# EAGLE design Pi3B+_Adapter (EAGLE 9.4.2)
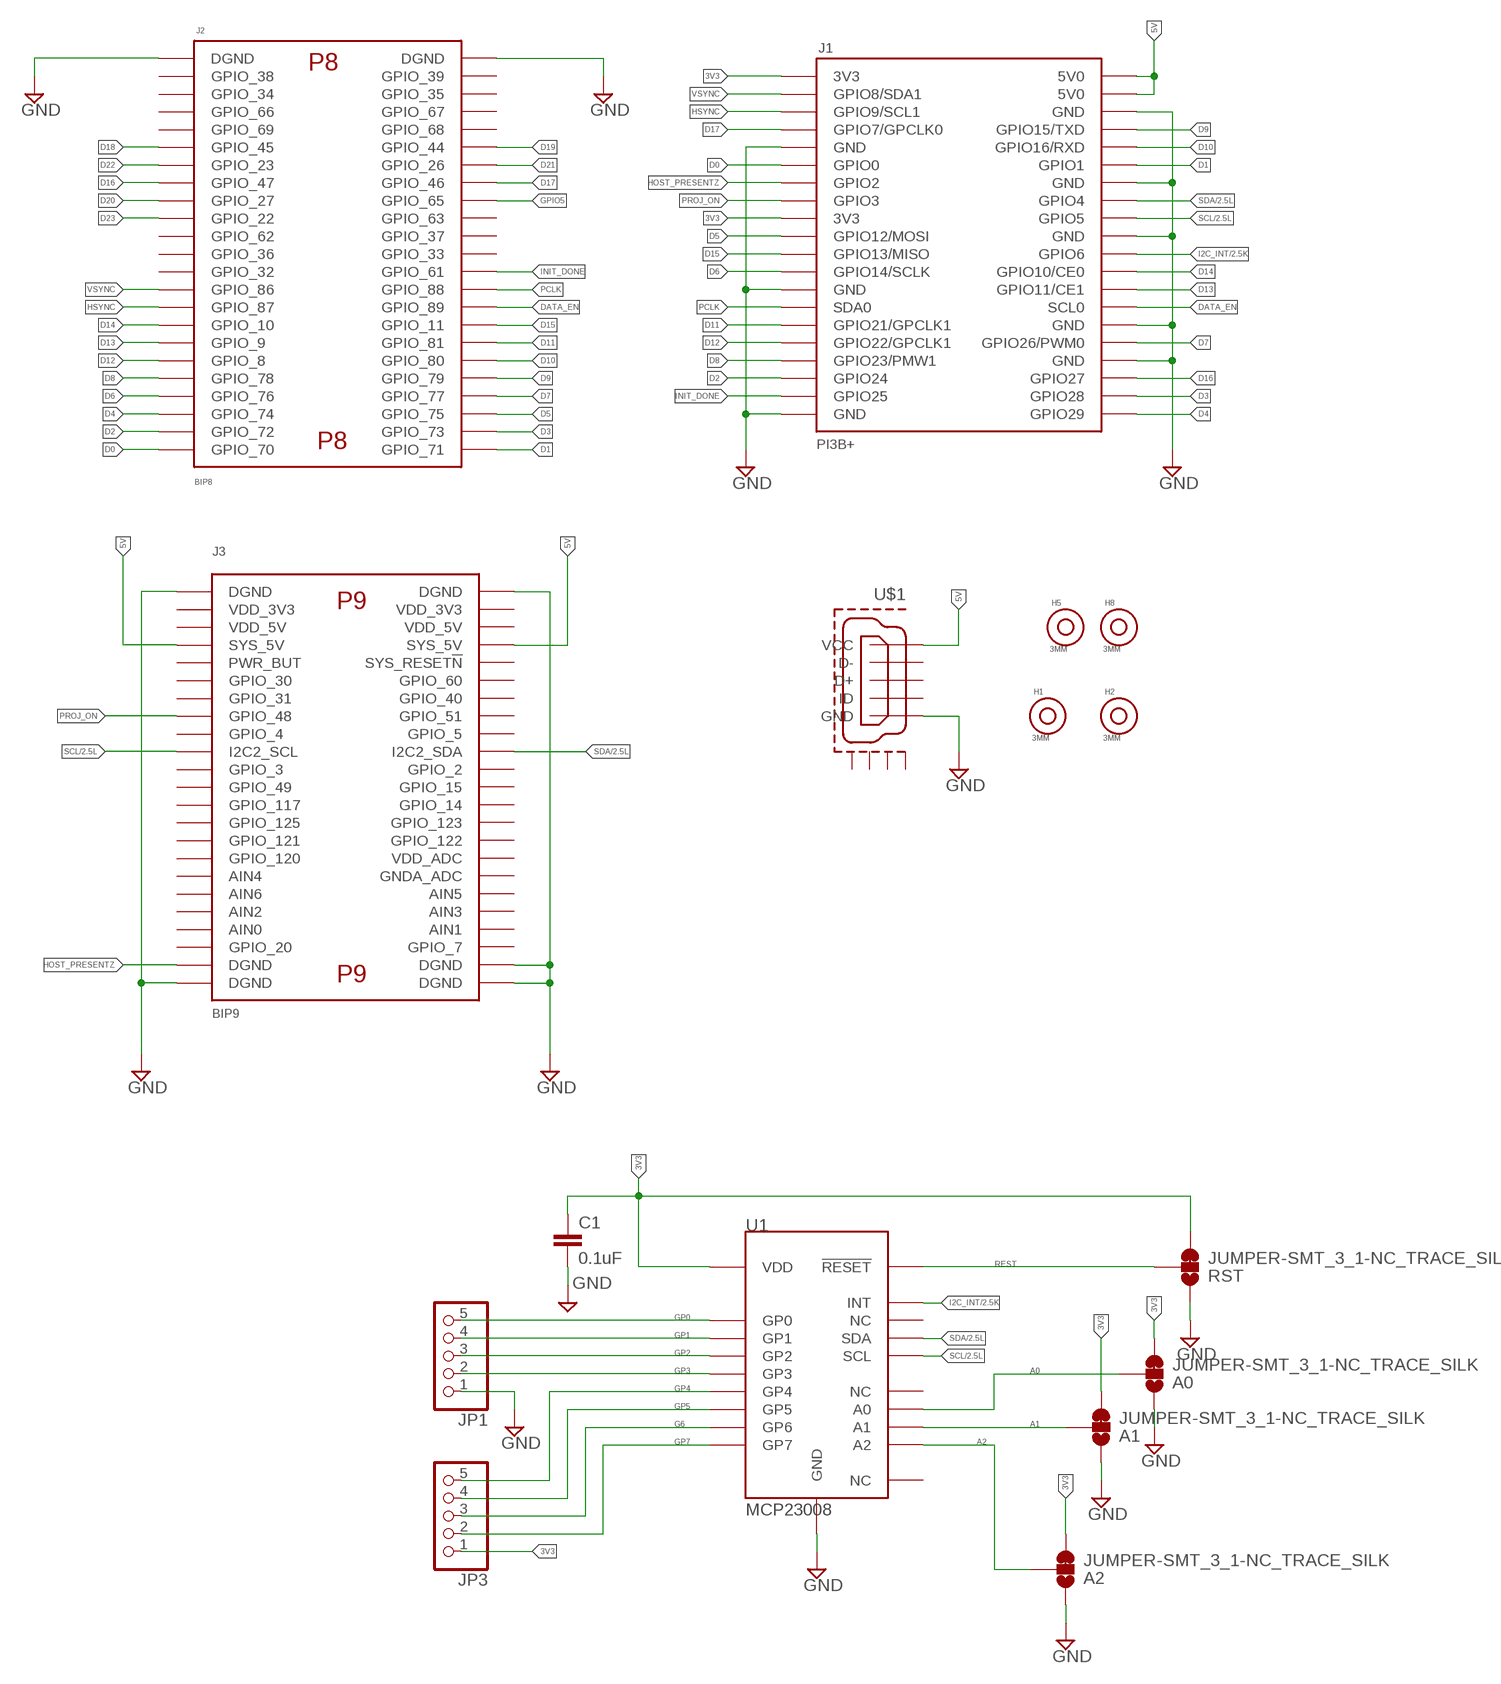
[diagram p0: schematic, sheet 1]

## Parts
A0  JUMPER-SMT_3_1-NC_TRACE_SILK  [SMT-JUMPER_3_1-NC_TRACE_SILK]
A1  JUMPER-SMT_3_1-NC_TRACE_SILK  [SMT-JUMPER_3_1-NC_TRACE_SILK]
A2  JUMPER-SMT_3_1-NC_TRACE_SILK  [SMT-JUMPER_3_1-NC_TRACE_SILK]
C1  0.1uF  0.1UF-0402-16V-10%  [0402]
H1  3MM  [3MM]
H2  3MM  [3MM]
H5  3MM  [3MM]
H8  3MM  [3MM]
J1  PI3B+  [PI3B+]
J2  BIP8  [BIP8]
J3  BIP9  [BIP9]
JP1  PINHD-1X55X2MM  [1_05X2MM]
JP3  PINHD-1X55X2MM  [1_05X2MM]
RST  JUMPER-SMT_3_1-NC_TRACE_SILK  [SMT-JUMPER_3_1-NC_TRACE_SILK]
U1  MCP23008  [MCP23008SS]
U$1  MICRO-USB-RECEPTACLE47589-0001  [47589-0001]

## Nets
3V3: A0.3 A1.3 A2.3 C1.1 J1.3V3 J1.3V3@1(3V3) JP3.1 RST.3 U1.VDD
5V: J1.5V0 J1.5V0@1(5V0) J3.SYS_5V J3.SYS_5V@1(SYS_5V) U$1.V-BUS(VCC)
A0: A0.2 U1.A0
A1: A1.2 U1.A1
A2: A2.2 U1.A2
D0: J1.GPIO0 J2.GPIO_70
D1: J1.GPIO1 J2.GPIO_71
D2: J1.GPIO24 J2.GPIO_72
D3: J1.GPIO28 J2.GPIO_73
D4: J1.GPIO29 J2.GPIO_74
D5: J1.GPIO12/MOSI J2.GPIO_75
D6: J1.GPIO14/SCLK J2.GPIO_76
D7: J1.GPIO26/PMW0(GPIO26/PWM0) J2.GPIO_77
D8: J1.GPIO23/PWM1(GPIO23/PMW1) J2.GPIO_78
D9: J1.GPIO15/TXD J2.GPIO_79
D10: J1.GPIO16/RXD J2.GPIO_80
D11: J1.GPIO21/GPCLK1 J2.GPIO_81
D12: J1.GPIO22/GPCLK2(GPIO22/GPCLK1) J2.GPIO_8
D13: J1.GPIO11/CE1 J2.GPIO_9
D14: J1.GPIO10/CE0 J2.GPIO_10
D15: J1.GPIO13/MISO J2.GPIO_11
D16: J1.GPIO27 J2.GPIO_47
D17: J1.GPIO7/GPCLK0 J2.GPIO_46
D18: J2.GPIO_45
D19: J2.GPIO_44
D20: J2.GPIO_27
D21: J2.GPIO_26
D22: J2.GPIO_23
D23: J2.GPIO_22
DATA_EN: J1.SCL0 J2.GPIO_89
G6: JP3.3 U1.GP6
GND: A0.1 A1.1 A2.1 C1.2 J1.GND J1.GND@1(GND) J1.GND@2(GND) J1.GND@3(GND) J1.GND@4(GND) J1.GND@5(GND) J1.GND@6(GND) J1.GND@7(GND) J2.DGND J2.DGND@1(DGND) J3.DGND J3.DGND@1(DGND) J3.DGND@4(DGND) J3.DGND@5(DGND) J3.DGND@6(DGND) JP1.1 RST.1 U1.GND U$1.GND
GP0: JP1.5 U1.GP0
GP1: JP1.4 U1.GP1
GP2: JP1.3 U1.GP2
GP3: JP1.2 U1.GP3
GP4: JP3.5 U1.GP4
GP5: JP3.4 U1.GP5
GP7: JP3.2 U1.GP7
GPIO5: J2.GPIO_65
HOST_PRESENTZ: J1.GPIO2 J3.DGND@3(DGND)
HSYNC: J1.GPIO9/SCL1 J2.GPIO_87
I2C_INT/2.5K: J1.GPIO6 U1.INT
INIT_DONE: J1.GPIO25 J2.GPIO_61
PCLK: J1.SDA0 J2.GPIO_88
PROJ_ON: J1.GPIO3 J3.GPIO_48
REST: RST.2 U1.!RESET
SCL/2.5L: J1.GPIO5 J3.I2C2_SCL U1.SCL
SDA/2.5L: J1.GPIO4 J3.I2C2_SDA U1.SDA
VSYNC: J1.GPIO8/SDA1 J2.GPIO_86
Unconnected: J2.GPIO_32 J2.GPIO_33 J2.GPIO_34 J2.GPIO_35 J2.GPIO_36 J2.GPIO_37 J2.GPIO_38 J2.GPIO_39 J2.GPIO_62 J2.GPIO_63 J2.GPIO_66 J2.GPIO_67 J2.GPIO_68 J2.GPIO_69 J3.AIN0 J3.AIN1 J3.AIN2 J3.AIN3 J3.AIN4 J3.AIN5 J3.AIN6 J3.GNDA_ADC J3.GPIO_2 J3.GPIO_3 J3.GPIO_4 J3.GPIO_5 J3.GPIO_7 J3.GPIO_14 J3.GPIO_15 J3.GPIO_20 J3.GPIO_30 J3.GPIO_31 J3.GPIO_40 J3.GPIO_49 J3.GPIO_51 J3.GPIO_60 J3.GPIO_117 J3.GPIO_120 J3.GPIO_121 J3.GPIO_122 J3.GPIO_123 J3.GPIO_125 J3.PWR_BUT J3.SYS_RESET!N J3.VDD_3V3 J3.VDD_3V3@1(VDD_3V3) J3.VDD_5V J3.VDD_5V@1(VDD_5V) J3.VDD_ADC U1.NC U1.NC@1(NC) U1.NC@2(NC) U$1.CASING1(GND1) U$1.CASING2(GND2) U$1.CASING3(GND3) U$1.CASING4(GND4) U$1.D+ U$1.D- U$1.ID

## Library data of the parts
A0 A1 A2 RST = SparkFun-Jumpers:JUMPER-SMT_3_1-NC_TRACE: Normally closed trace jumper (1 of 2 connections) This jumper has a trace between two pads so it's normally closed (NC). The other connection is normally open (NO). Use a razor knife to open the connection. For best results follow the IPC guidelines for cutting traces: Cutout at least 0.063 mm (0.005 in). Remove all loose material to clean up the cut area. Seal the cut with an approved epoxy. Reapply solder to reclose the connection, or to close the NO connection.
C1 = SparkFun-Capacitors:0.1UF: 0.1µF ceramic capacitors A capacitor is a passive two-terminal electrical component used to store electrical energy temporarily in an electric field.; PROD_ID: CAP-12416
H1 H2 H5 H8 = Mounting-holes:3MM
J1 = Raspberry_pi3+:PI3B+
J2 = DLP2000:BIP8
J3 = DLP2000:BIP9
JP1 JP3 = pinhead:PINHD-1X5: PIN HEADER
U1 = MCP23008:MCP23008
U$1 = con-molex-usb:MICRO-USB-RECEPTACLE: MICRO USB RECEPTACLES Micro-USB Receptacles, SMT, Lead-Free from MOLEX <http://www.molex.com/>. (C) 2014 Tomasz Boleslaw CEDRO, cederom@tlen.pl, http://www.tomek.cedro.info. Version 0.1 (2014-01-17): Initial release. Version 0.2 (2014-02-06): Updated 47589-0001 footprint pins/pads/milling. Following devices are included: 1. 47589-0001 Micro-USB AB Receptacle, Bottom Mount, SMT, Lead-Free <http://www.molex.com/molex/products/datasheet.jsp?part=active/0475890001_IO_CONNECTORS.xml> (Technical Drawing <http://www.molex.com/pdm_docs/sd/475890001_sd.pdf>).

## Board
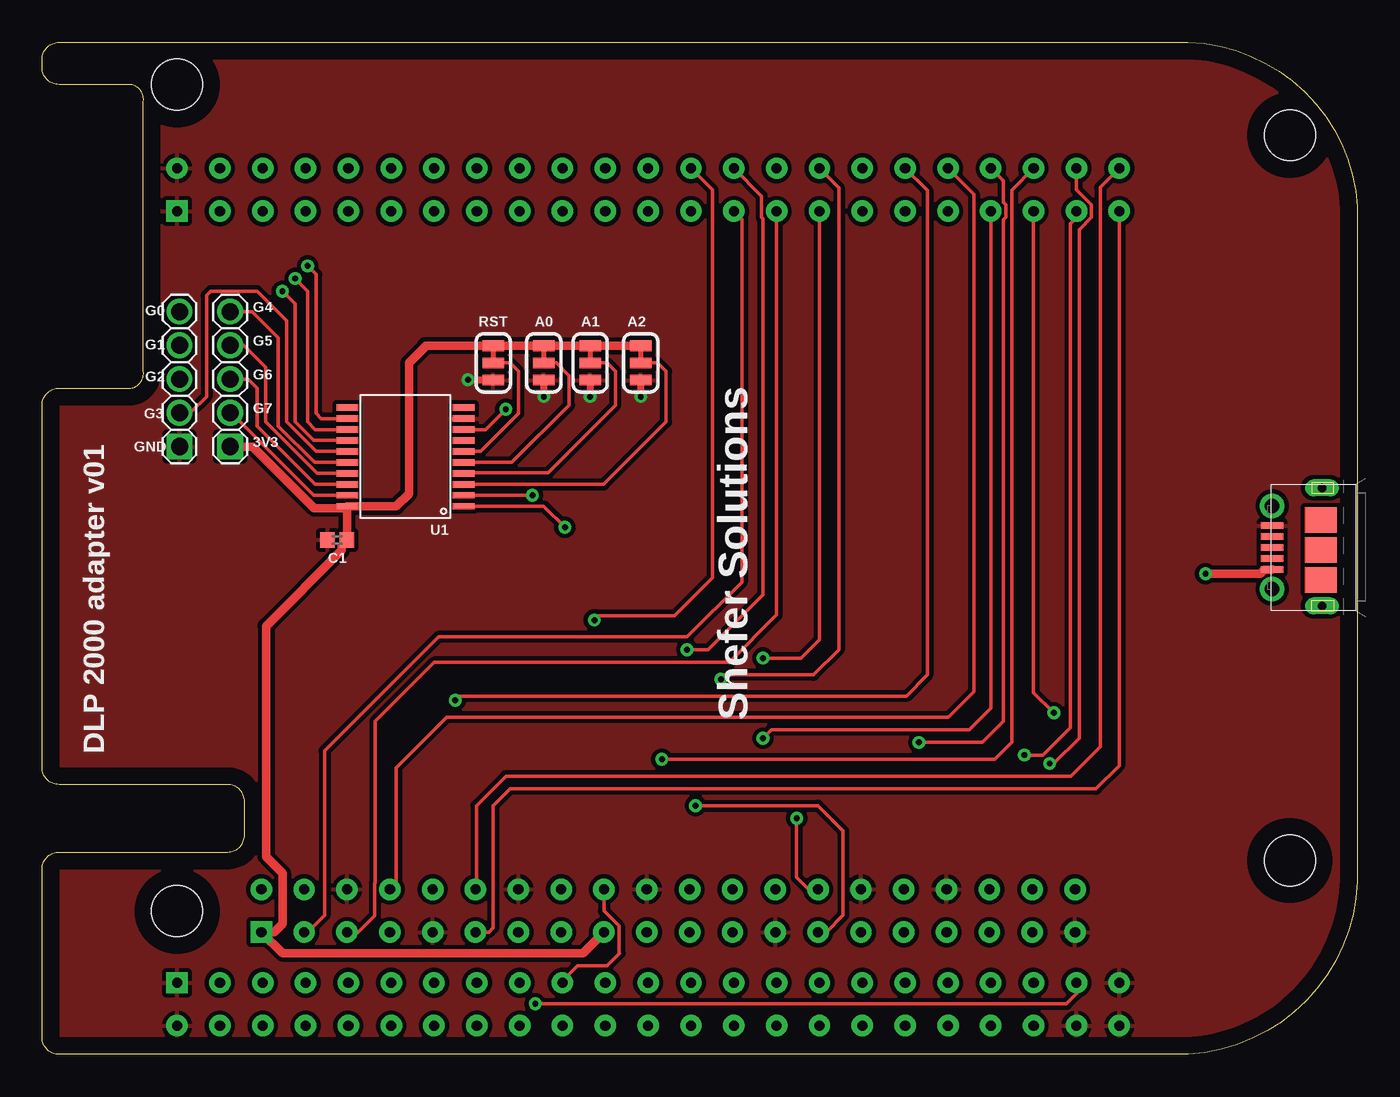
[diagram p1: board, top side]
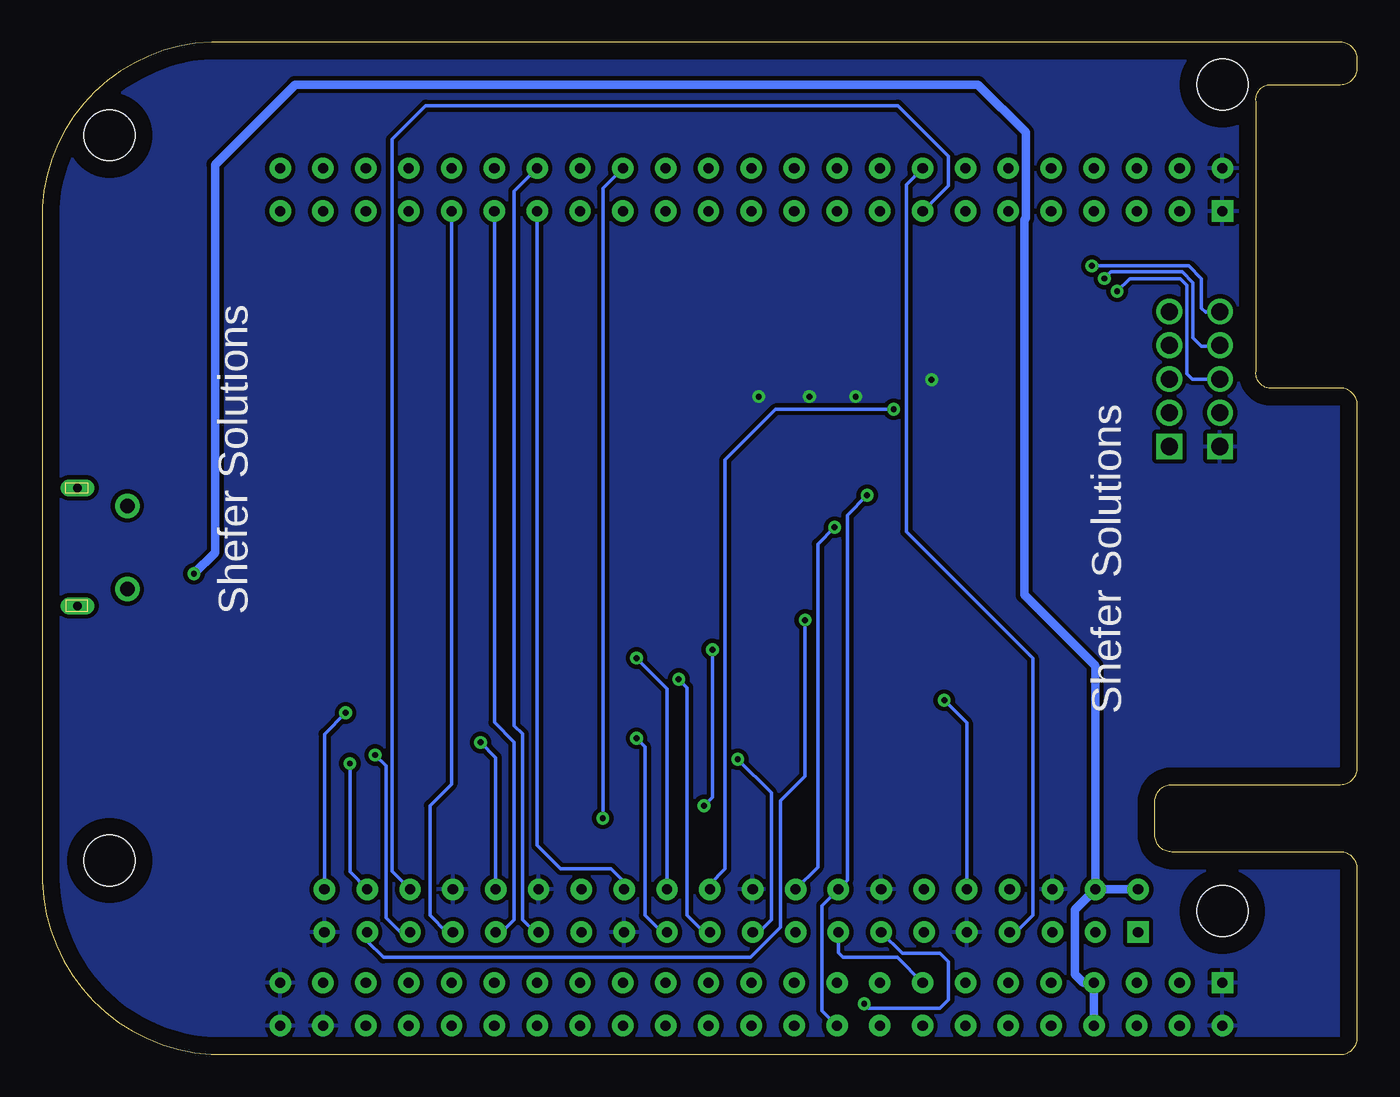
[diagram p2: board, bottom side, seen from below]

Size 78 x 60.01 mm. Coordinates in mm from the lower left corner, seen from the top.
Outline: 1,0 arc-90 0,1 0,11 arc-90 1,12 11,12 arc90 12,13 12,15 arc90 11,16 1,16 arc-90 0,17 0,38.5 arc-90 1,39.5 5.25,39.5 arc90 6,40.5 6,56.5 arc90 5.25,57.5 1,57.5 arc-90 0,58.5 0,59 arc-90 1,60 67,60 arc-90 78,50.25 78,10.25 arc-90 67,0 1,0
Copper layers (1*16): Top 0.035mm / dielectric 1.5mm / Bottom 0.035mm
Design rules "default": minimum track width 6mil, minimum drill 0.35mm, track to track 6mil, track to pad 6mil, pad to pad 6mil, via to via 6mil, smd to smd 6mil, copper to edge 40mil, drill to drill 6mil, minimum pad ring 10mil, minimum via ring 8mil, stop-mask expansion 4mil, vias tented up to drill 0mil, thermal gap 10mil

### Footprints (pad centres in the part's own frame; a part is rotated, then mirrored left to right if it is on the bottom)
SMT-JUMPER_3_1-NC_TRACE_SILK = smd 0.635 x 1.27: 1 -1.016,0; 2 0,0; 3 1.016,0
0402 = smd 0.85 x 0.9: 1 -0.58,0; 2 0.58,0
3MM = hole 3: 0,0
PI3B+ = drill 0.6 pad 1.27 square: 3V3 0,0 | drill 0.6 pad 1.27: 3V3@1 0,-20.32; 5V0 2.54,0; 5V0@1 2.54,-2.54; GND 2.54,-5.08; GND@1 0,-10.16; GND@2 2.54,-15.24; GND@3 2.54,-22.86; GND@4 0,-30.48; GND@5 2.54,-35.56; GND@6 2.54,-40.64; GND@7 0,-48.26; GPIO0 0,-12.7; GPIO1 2.54,-12.7; GPIO2 0,-15.24; GPIO3 0,-17.78; GPIO4 2.54,-17.78; GPIO5 2.54,-20.32; GPIO6 2.54,-25.4; GPIO7/GPCLK0 0,-7.62; GPIO8/SDA1 0,-2.54; GPIO9/SCL1 0,-5.08; GPIO10/CE0 2.54,-27.94; GPIO11/CE1 2.54,-30.48; GPIO12/MOSI 0,-22.86; GPIO13/MISO 0,-25.4; GPIO14/SCLK 0,-27.94; GPIO15/TXD 2.54,-7.62; GPIO16/RXD 2.54,-10.16; GPIO21/GPCLK1 0,-35.56; GPIO22/GPCLK2 0,-38.1; GPIO23/PWM1 0,-40.64; GPIO24 0,-43.18; GPIO25 0,-45.72; GPIO26/PMW0 2.54,-38.1; GPIO27 2.54,-43.18; GPIO28 2.54,-45.72; GPIO29 2.54,-48.26; SCL0 2.54,-33.02; SDA0 0,-33.02
BIP8 = drill 0.6 pad 1.27 square: DGND 0,0 | drill 0.6 pad 1.27: DGND@1 2.54,0; GPIO_8 0,-43.18; GPIO_9 0,-40.64; GPIO_10 0,-38.1; GPIO_11 2.54,-38.1; GPIO_22 0,-22.86; GPIO_23 0,-15.24; GPIO_26 2.54,-15.24; GPIO_27 0,-20.32; GPIO_32 0,-30.48; GPIO_33 2.54,-27.94; GPIO_34 0,-5.08; GPIO_35 2.54,-5.08; GPIO_36 0,-27.94; GPIO_37 2.54,-25.4; GPIO_38 0,-2.54; GPIO_39 2.54,-2.54; GPIO_44 2.54,-12.7; GPIO_45 0,-12.7; GPIO_46 2.54,-17.78; GPIO_47 0,-17.78; GPIO_61 2.54,-30.48; GPIO_62 0,-25.4; GPIO_63 2.54,-22.86; GPIO_65 2.54,-20.32; GPIO_66 0,-7.62; GPIO_67 2.54,-7.62; GPIO_68 2.54,-10.16; GPIO_69 0,-10.16; GPIO_70 0,-55.88; GPIO_71 2.54,-55.88; GPIO_72 0,-53.34; GPIO_73 2.54,-53.34; GPIO_74 0,-50.8; GPIO_75 2.54,-50.8; GPIO_76 0,-48.26; GPIO_77 2.54,-48.26; GPIO_78 0,-45.72; GPIO_79 2.54,-45.72; GPIO_80 2.54,-43.18; GPIO_81 2.54,-40.64; GPIO_86 0,-33.02; GPIO_87 0,-35.56; GPIO_88 2.54,-33.02; GPIO_89 2.54,-35.56
BIP9 = drill 0.6 pad 1.27: AIN0 0,-48.26; AIN1 2.54,-48.26; AIN2 0,-45.72; AIN3 2.54,-45.72; AIN4 0,-40.64; AIN5 2.54,-43.18; AIN6 0,-43.18; DGND@1 2.54,0; DGND@3 0,-53.34; DGND@4 2.54,-53.34; DGND@5 0,-55.88; DGND@6 2.54,-55.88; GNDA_ADC 2.54,-40.64; GPIO_2 2.54,-25.4; GPIO_3 0,-25.4; GPIO_4 0,-20.32; GPIO_5 2.54,-20.32; GPIO_7 2.54,-50.8; GPIO_14 2.54,-30.48; GPIO_15 2.54,-27.94; GPIO_20 0,-50.8; GPIO_30 0,-12.7; GPIO_31 0,-15.24; GPIO_40 2.54,-15.24; GPIO_48 0,-17.78; GPIO_49 0,-27.94; GPIO_51 2.54,-17.78; GPIO_60 2.54,-12.7; GPIO_117 0,-30.48; GPIO_120 0,-38.1; GPIO_121 0,-35.56; GPIO_122 2.54,-35.56; GPIO_123 2.54,-33.02; GPIO_125 0,-33.02; I2C2_SCL 0,-22.86; I2C2_SDA 2.54,-22.86; PWR_BUT 0,-10.16; SYS_5V 0,-7.62; SYS_5V@1 2.54,-7.62; SYS_RESET!N 2.54,-10.16; VDD_3V3 0,-2.54; VDD_3V3@1 2.54,-2.54; VDD_5V 0,-5.08; VDD_5V@1 2.54,-5.08; VDD_ADC 2.54,-38.1 | drill 0.6 pad 1.27 square: DGND 0,0
1_05X2MM = drill 1.016 pad 1.3 square: 1 -4,0 | drill 1.016 pad 1.3: 2 -2,0; 3 0,0; 4 2,0; 5 4,0
MCP23008SS = smd 1.3 x 0.38: !RESET -3.5,-0.25; A0 -3.5,0.4; A1 -3.5,1.05; A2 -3.5,1.7; GND -3.5,-2.2; GP0 3.4,-2.2; GP1 3.4,-1.55; GP2 3.4,-0.9; GP3 3.4,-0.25; GP4 3.4,0.4; GP5 3.4,1.05; GP6 3.4,1.7; GP7 3.4,2.35; INT -3.5,-1.55; NC -3.5,-0.9; NC@1 -3.5,-2.85; NC@2 3.4,-2.85; SCL -3.5,3; SDA -3.5,2.35; VDD 3.4,3
47589-0001 = drill 0.5 pad 0.95 long: CASING1 7.25,3; CASING2 0.25,3 | drill 0.85 pad 1.45: CASING3 6.251,0.048; CASING4 1.321,0.048 | smd 0.4 x 1.35: D+ 3.786,0.048; D- 4.436,0.048; GND 2.486,0.048; ID 3.136,0.048; V-BUS 5.086,0.048 | smd 1.5 x 1.9: P$1 2.159,2.921; P$2 3.937,2.921; P$3 5.715,2.921

### Placement (x,y rotation side)
A0  29.75,41 90 top
A1  32.5,41 90 top
A2  35.5,41 90 top
C1  17.5,30.5 180 top
H1  74,54.5 0 top
H2  74,11.5 0 top
H5  8,8.5 0 top
H8  8,57.5 0 top
J1  13,7.25 90 top
J2  8,50 90 top
J3  8,4.25 270 bottom
JP1  8.15,40.04 90 top
JP3  11.15,40.04 90 top
RST  26.75,41 90 top
U1  21.5,35.5 180 top
U$1  72.9,33.84 270 top

### Tracks (layer width: path | path; a pad name or v marks a point on that pad's centre or on a via)
3V3
  Top 0.508: U1.VDD 18.1,30.5 C1.1 17.75,30.17 17.75,29.88 13.27,25.4 13.27,11.73 14.25,10.75 14.25,7.75 13.75,7.25 J1.3V3 14.25,6 32.07,6 J1.3V3@1 | U1.VDD 17.99,32.39 16.14,32.39 12.49,36.04 JP3.1 | U1.VDD 21,32.5 21.75,33.25 21.75,41 22.75,42 22.73,42.02 RST.3 A0.3 A1.3 A2.3
5V  (via drill 0.35)
  Top 0.508: v69,28.5 72.25,28.5 72.48,28.72 72.91,28.72 U$1.V-BUS
  Bottom 0.508: J1.5V0 J1.5V0@1 | J1.5V0@1 16.75,8.58 16.75,4.75 16.25,4.25 J3.SYS_5V J3.SYS_5V@1 | J1.5V0@1 15.54,23.04 19.75,27.25 19.75,49.48 19.66,49.57 19.66,54.66 22.5,57.5 63,57.5 67.75,52.75 67.75,29.75 v69,28.5
A0
  Top 0.203: U1.A0 27.85,35.1 31.25,38.5 31.25,40.25 30.5,41 A0.2
A1
  Top 0.203: U1.A1 25.05,34.5 30,34.5 34,38.5 34,40.5 33.5,41 A1.2
A2
  Top 0.203: U1.A2 33.3,33.8 37,37.5 37,40.5 36.5,41 A2.2
D0
  Top 0.203: J2.GPIO_70 63.88,17.13 62.5,15.75 27.75,15.75 26.75,14.75 26.75,7.5 26.5,7.25 J1.GPIO0
D1
  Top 0.203: J2.GPIO_71 62.75,51.41 62.75,18.25 61,16.5 27.5,16.5 25.75,14.75 25.75,9.84 J1.GPIO1
D2  (via drill 0.35)
  Top 0.203: J2.GPIO_72 61.34,49.61 60.98,49.26 60.98,19.38 59.36,17.75 v58.25,17.75
  Bottom 0.203: J1.GPIO24 56.75,7.25 57.61,8.11 57.61,17.11 v58.25,17.75
D3  (via drill 0.35)
  Top 0.203: J2.GPIO_73 61.34,51.26 62.23,50.37 62.23,49.63 61.5,48.9 61.5,18.75 60,17.25 v59.75,17.25
  Bottom 0.203: v59.75,17.25 59.75,10.82 J1.GPIO28
D4  (via drill 0.35)
  Top 0.203: J2.GPIO_74 58.8,21.45 v60,20.25
  Bottom 0.203: v60,20.25 61.26,18.99 J1.GPIO29
D5  (via drill 0.35)
  Top 0.203: J2.GPIO_75 57.5,51.24 57.5,50.52 57.51,50.52 57.51,18.5 56.5,17.5 v36.75,17.5
  Bottom 0.203: v36.75,17.5 34.75,15.5 34.75,8 35.5,7.25 J1.GPIO12/MOSI
D6  (via drill 0.35)
  Top 0.203: J2.GPIO_76 56.26,20.51 55,19.25 43.25,19.25 v42.75,18.75
  Bottom 0.203: v42.75,18.75 42.25,18.25 42.25,8.25 41.25,7.25 J1.GPIO14/SCLK
D7  (via drill 0.35)
  Top 0.203: J2.GPIO_77 57,51.8 57,50.52 57.15,50.37 57.15,49.63 57,49.48 57,19.75 55.75,18.5 v52,18.5
  Bottom 0.203: v52,18.5 51.1,17.6 J1.GPIO26/PMW0
D8
  Bottom 0.203: J2.GPIO_78 53.72,16.03 55,14.75 55,8.25 54,7.25 J1.GPIO23/PWM1
D9
  Top 0.203: J2.GPIO_79 55.25,51.01 55.25,21.5 53.75,20 24,20 21,17 21,10.17 J1.GPIO15/TXD
D10  (via drill 0.35)
  Top 0.203: J2.GPIO_80 52.5,51.22 52.5,22.5 51.25,21.25 24.75,21.25 v24.5,21
  Bottom 0.203: v24.5,21 23.16,19.66 J1.GPIO16/RXD
D11
  Bottom 0.203: J2.GPIO_81 50,51.18 50,19.5 49.5,19 49.5,8 48.75,7.25 J1.GPIO21/GPCLK1
D12
  Bottom 0.203: J2.GPIO_8 51.18,19.68 50,18.5 50,8 50.75,7.25 J1.GPIO22/GPCLK2
D13
  Bottom 0.203: J2.GPIO_9 48.64,12.39 47.25,11 44.25,11 43.48,10.23 J1.GPIO11/CE1
D14  (via drill 0.35)
  Top 0.203: J2.GPIO_10 46.1,24.6 45,23.5 v42.75,23.5
  Bottom 0.203: v42.75,23.5 40.94,21.69 J1.GPIO10/CE0
D15  (via drill 0.35)
  Top 0.203: J2.GPIO_11 47.25,51.39 47.25,24 45.75,22.5 40.5,22.5 v40.25,22.25
  Bottom 0.203: v40.25,22.25 39.75,21.75 39.75,8.25 38.75,7.25 J1.GPIO13/MISO
D16
  Bottom 0.203: J1.GPIO27 57.25,10.86 57.25,54.25 55.25,56.25 27.25,56.25 24.25,53.25 24.25,51.5 25.75,50 J2.GPIO_47
D17
  Bottom 0.203: J2.GPIO_46 26.75,51.57 26.75,31 19.25,23.5 19.25,8.25 20.25,7.25 J1.GPIO7/GPCLK0
DATA_EN  (via drill 0.35)
  Top 0.203: v44.75,14 44.75,10.5 45.46,9.79 J1.SCL0
  Bottom 0.203: J2.GPIO_89 44.75,51.35 v44.75,14
G6
  Top 0.203: U1.GP6 16.2,33.8 12.75,37.25 12.75,39.5 12.21,40.04 JP3.3
GND  (via drill 0.35)
  Top 0.406: A0.1 v29.75,39 | A1.1 v32.5,39 | A2.1 v35.5,39 | RST.1 25.27,39.98 v25.25,40
  pour Top (isolate 0.254): 1,0 arc-90 0,1 0,11 arc-90 1,12 11,12 arc90 12,13 12,15 arc90 11,16 1,16 arc-90 0,17 0,38.5 arc-90 1,39.5 5.25,39.5 arc90 6,40.5 6,56.5 arc90 5.25,57.5 1,57.5 arc-90 0,58.5 0,59 arc-90 1,60 67,60 arc-90 78,50.25 78,10.25 arc-90 67,0
  pour Bottom (isolate 0.254): 1,0 arc-90 0,1 0,11 arc-90 1,12 11,12 arc90 12,13 12,15 arc90 11,16 1,16 arc-90 0,17 0,38.5 arc-90 1,39.5 5.25,39.5 arc90 6,40.5 6,56.5 arc90 5.25,57.5 1,57.5 arc-90 0,58.5 0,59 arc-90 1,60 67,60 arc-90 78,50.25 78,10.25 arc-90 67,0
GP0  (via drill 0.35)
  Top 0.203: U1.GP0 16.55,37.7 16.25,38 16.25,46.25 v15.75,46.75
  Bottom 0.203: JP1.5 8.96,44.04 9,44 9.25,44.25 9.25,46 10,46.75 v15.75,46.75
GP1  (via drill 0.35)
  Top 0.203: U1.GP1 16.2,37.05 15.75,37.5 15.75,45.25 v15,46
  Bottom 0.203: JP1.4 8.19,42 9.25,42 9.75,42.5 9.75,45.75 10.39,46.39 14.61,46.39 v15,46
GP2  (via drill 0.35)
  Top 0.203: U1.GP2 16.1,36.4 15,37.5 15,44.5 v14.25,45.25
  Bottom 0.203: JP1.3 9.79,40.04 10.11,40.36 10.11,45.6 10.5,46 13.5,46 v14.25,45.25
GP3
  Top 0.203: JP1.2 8.79,38.04 9.75,39 9.75,45 10,45.25 12.75,45.25 14.5,43.5 14.5,37.5 16.25,35.75 U1.GP3
GP4
  Top 0.203: U1.GP4 16.15,35.1 14,37.25 14,42.5 12.46,44.04 JP3.5
GP5
  Top 0.203: JP3.4 11.96,42.04 13.25,40.75 13.25,37.5 16.3,34.45 U1.GP5
GP7
  Top 0.203: U1.GP7 16.1,33.15 11.21,38.04 JP3.2
HOST_PRESENTZ  (via drill 0.35)
  Top 0.203: v29.25,3 60.75,3 61.34,3.59 J3.DGND@3
  Bottom 0.203: J1.GPIO2 26.99,6 24.75,6 24.25,5.5 24.25,3.25 24.75,2.75 29,2.75 v29.25,3
HSYNC
  Top 0.203: J2.GPIO_87 43.56,26.06 40.75,23.25 23.25,23.25 19.75,19.75 19.75,10.18 19.73,10.16 19.73,8.23 18.75,7.25 J1.GPIO9/SCL1
I2C_INT/2.5K  (via drill 0.35)
  Top 0.203: U1.INT 26.3,37.05 v27.5,38.25
  Bottom 0.203: v27.5,38.25 34.5,38.25 37.5,35.25 37.5,11 38.4,10.1 J1.GPIO6
INIT_DONE  (via drill 0.35)
  Top 0.203: J2.GPIO_61 39.75,51.27 39.75,28.25 37.5,26 33,26 v32.75,25.75
  Bottom 0.203: v32.75,25.75 32.75,16.5 34.21,15.04 34.21,7.54 36,5.75 57.75,5.75 58.72,6.72 J1.GPIO25
PCLK  (via drill 0.35)
  Top 0.203: J2.GPIO_88 42.67,50.89 42.67,49.63 42.75,49.55 42.75,27.25 39.5,24 v38.25,24 | v38.75,14.75 46,14.75 47.5,13.25 47.5,8.25 46.5,7.25 J1.SDA0
  Bottom 0.203: v38.25,24 38.25,15.25 v38.75,14.75
PROJ_ON
  Bottom 0.203: J3.GPIO_48 27.28,5.75 30.5,5.75 30.78,6.03 J1.GPIO3
REST
  Top 0.203: U1.!RESET 26,35.75 28.25,38 28.25,40.5 27.75,41 RST.2
SCL/2.5L  (via drill 0.35)
  Top 0.203: J1.GPIO5 33.32,8.51 34.21,7.62 34.21,6.04 34.25,6 33.5,5.25 31.75,5.25 30.86,4.36 J3.I2C2_SCL | v31,31.25 29.75,32.5 U1.SCL
  Bottom 0.203: v31,31.25 32,30.25 32,11.11 J1.GPIO5
SDA/2.5L  (via drill 0.35)
  Top 0.203: v29.07,33.15 U1.SDA
  Bottom 0.203: J3.I2C2_SDA 31.75,2.6 31.75,8.82 J1.GPIO4 30.25,10.32 30.25,30.61 30.24,30.61 30.24,31.98 v29.07,33.15
VSYNC
  Top 0.203: J2.GPIO_86 41.5,49.52 41.5,28 38.25,24.75 23.5,24.75 16.75,18 16.75,8.25 15.75,7.25 J1.GPIO8/SDA1

### Text on the board
tPlace: G0 | G4 | G1 | G5 | G2 | G6 | G3 | G7 | GND | 3V3 | Shefer Solutions | DLP 2000 adapter v01
bPlace: Shefer Solutions | Shefer Solutions